# Altium schematic sheet 19_SOLEDNOID_2.SchDoc
size 420 x 297 mm; SheetNumber: 31; SheetTotal: 33
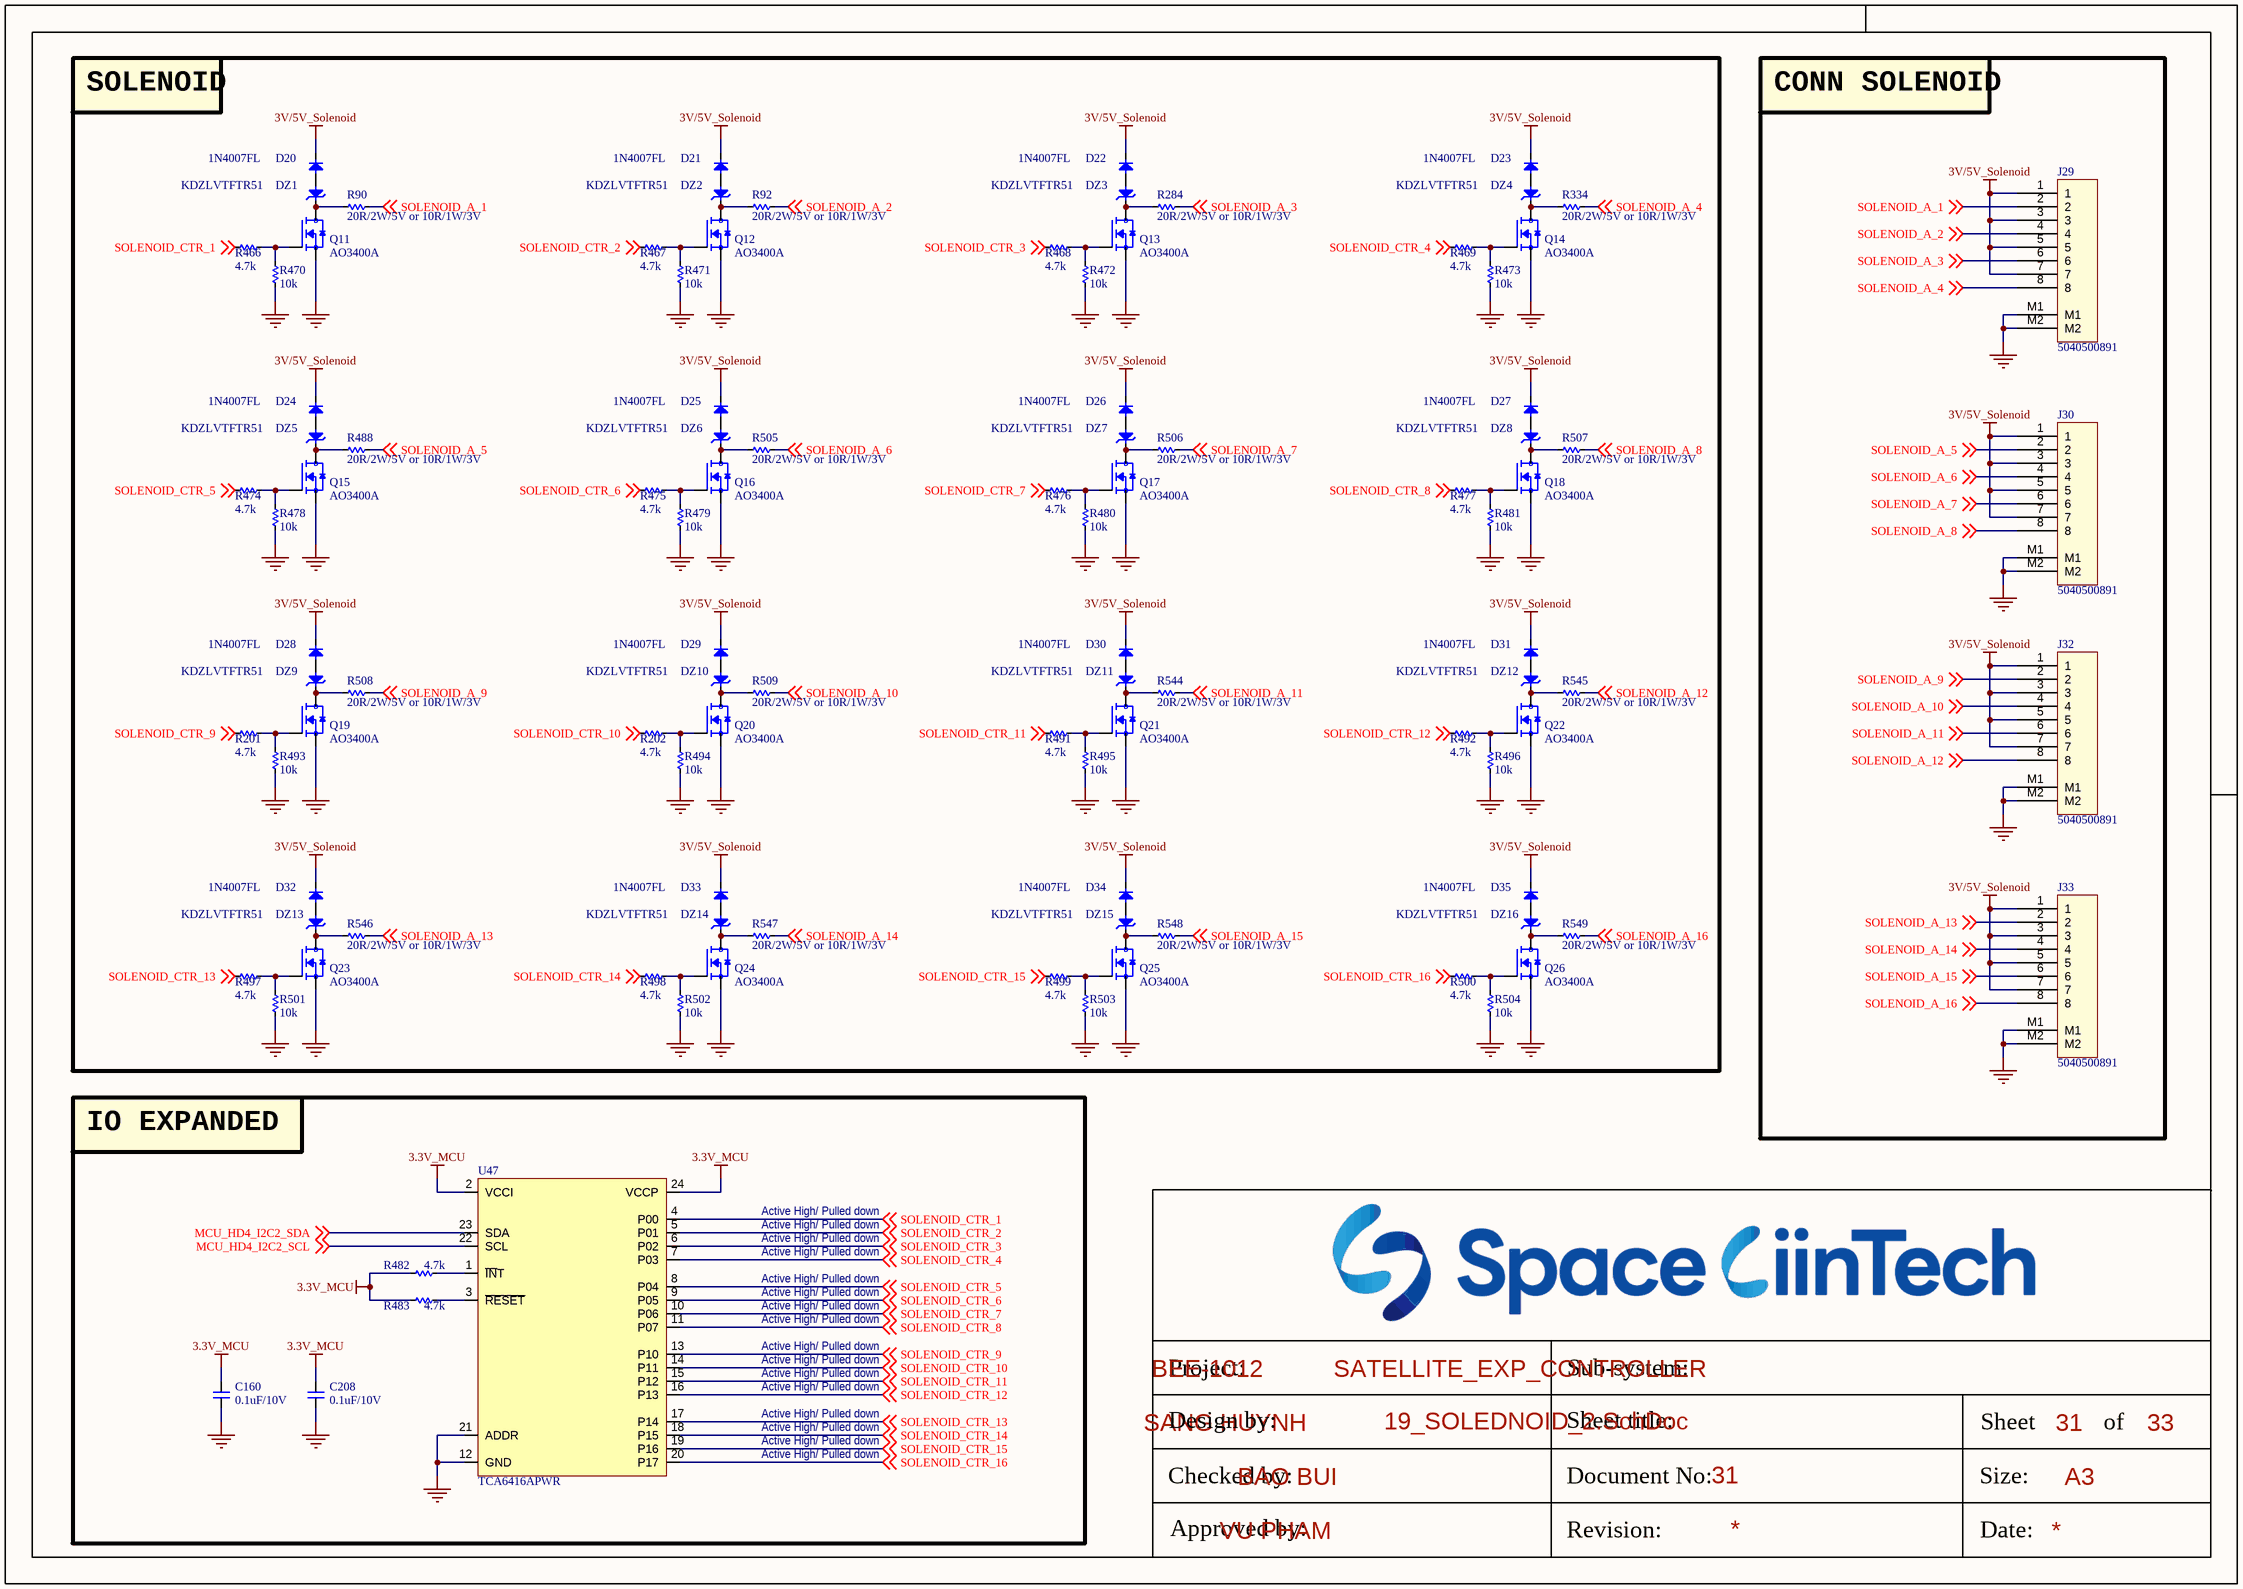
[diagram p0: 19_SOLEDNOID_2.SchDoc]

## Parts
C160  0.1uF/10V  [CAP_C_1005X50_L]
C208  0.1uF/10V  [CAP_C_1005X50_L]
D20  1N4007FL  [SOD3717X145N]
D21  1N4007FL  [SOD3717X145N]
D22  1N4007FL  [SOD3717X145N]
D23  1N4007FL  [SOD3717X145N]
D24  1N4007FL  [SOD3717X145N]
D25  1N4007FL  [SOD3717X145N]
D26  1N4007FL  [SOD3717X145N]
D27  1N4007FL  [SOD3717X145N]
D28  1N4007FL  [SOD3717X145N]
D29  1N4007FL  [SOD3717X145N]
D30  1N4007FL  [SOD3717X145N]
D31  1N4007FL  [SOD3717X145N]
D32  1N4007FL  [SOD3717X145N]
D33  1N4007FL  [SOD3717X145N]
D34  1N4007FL  [SOD3717X145N]
D35  1N4007FL  [SOD3717X145N]
DZ1  KDZLVTFTR51  [SOD3717X145N]
DZ2  KDZLVTFTR51  [SOD3717X145N]
DZ3  KDZLVTFTR51  [SOD3717X145N]
DZ4  KDZLVTFTR51  [SOD3717X145N]
DZ5  KDZLVTFTR51  [SOD3717X145N]
DZ6  KDZLVTFTR51  [SOD3717X145N]
DZ7  KDZLVTFTR51  [SOD3717X145N]
DZ8  KDZLVTFTR51  [SOD3717X145N]
DZ9  KDZLVTFTR51  [SOD3717X145N]
DZ10  KDZLVTFTR51  [SOD3717X145N]
DZ11  KDZLVTFTR51  [SOD3717X145N]
DZ12  KDZLVTFTR51  [SOD3717X145N]
DZ13  KDZLVTFTR51  [SOD3717X145N]
DZ14  KDZLVTFTR51  [SOD3717X145N]
DZ15  KDZLVTFTR51  [SOD3717X145N]
DZ16  KDZLVTFTR51  [SOD3717X145N]
J29  5040500891  [MOLEX_5040500891]
J30  5040500891  [MOLEX_5040500891]
J32  5040500891  [MOLEX_5040500891]
J33  5040500891  [MOLEX_5040500891]
Q11  AO3400A  [SOT95P240X120-3N]
Q12  AO3400A  [SOT95P240X120-3N]
Q13  AO3400A  [SOT95P240X120-3N]
Q14  AO3400A  [SOT95P240X120-3N]
Q15  AO3400A  [SOT95P240X120-3N]
Q16  AO3400A  [SOT95P240X120-3N]
Q17  AO3400A  [SOT95P240X120-3N]
Q18  AO3400A  [SOT95P240X120-3N]
Q19  AO3400A  [SOT95P240X120-3N]
Q20  AO3400A  [SOT95P240X120-3N]
Q21  AO3400A  [SOT95P240X120-3N]
Q22  AO3400A  [SOT95P240X120-3N]
Q23  AO3400A  [SOT95P240X120-3N]
Q24  AO3400A  [SOT95P240X120-3N]
Q25  AO3400A  [SOT95P240X120-3N]
Q26  AO3400A  [SOT95P240X120-3N]
R90  20R/2W/5V or 10R/1W/3V  [RES_C_6331X65_N]
R92  20R/2W/5V or 10R/1W/3V  [RES_C_6331X65_N]
R201  4.7k  [RES_C_1005x30_L]
R202  4.7k  [RES_C_1005x30_L]
R284  20R/2W/5V or 10R/1W/3V  [RES_C_6331X65_N]
R334  20R/2W/5V or 10R/1W/3V  [RES_C_6331X65_N]
R466  4.7k  [RES_C_1005x30_L]
R467  4.7k  [RES_C_1005x30_L]
R468  4.7k  [RES_C_1005x30_L]
R469  4.7k  [RES_C_1005x30_L]
R470  10k  [RES_C_1005x30_L]
R471  10k  [RES_C_1005x30_L]
R472  10k  [RES_C_1005x30_L]
R473  10k  [RES_C_1005x30_L]
R474  4.7k  [RES_C_1005x30_L]
R475  4.7k  [RES_C_1005x30_L]
R476  4.7k  [RES_C_1005x30_L]
R477  4.7k  [RES_C_1005x30_L]
R478  10k  [RES_C_1005x30_L]
R479  10k  [RES_C_1005x30_L]
R480  10k  [RES_C_1005x30_L]
R481  10k  [RES_C_1005x30_L]
R482  4.7k  [RES_C_1005x30_L]
R483  4.7k  [RES_C_1005x30_L]
R488  20R/2W/5V or 10R/1W/3V  [RES_C_6331X65_N]
R491  4.7k  [RES_C_1005x30_L]
R492  4.7k  [RES_C_1005x30_L]
R493  10k  [RES_C_1005x30_L]
R494  10k  [RES_C_1005x30_L]
R495  10k  [RES_C_1005x30_L]
R496  10k  [RES_C_1005x30_L]
R497  4.7k  [RES_C_1005x30_L]
R498  4.7k  [RES_C_1005x30_L]
R499  4.7k  [RES_C_1005x30_L]
R500  4.7k  [RES_C_1005x30_L]
R501  10k  [RES_C_1005x30_L]
R502  10k  [RES_C_1005x30_L]
R503  10k  [RES_C_1005x30_L]
R504  10k  [RES_C_1005x30_L]
R505  20R/2W/5V or 10R/1W/3V  [RES_C_6331X65_N]
R506  20R/2W/5V or 10R/1W/3V  [RES_C_6331X65_N]
R507  20R/2W/5V or 10R/1W/3V  [RES_C_6331X65_N]
R508  20R/2W/5V or 10R/1W/3V  [RES_C_6331X65_N]
R509  20R/2W/5V or 10R/1W/3V  [RES_C_6331X65_N]
R544  20R/2W/5V or 10R/1W/3V  [RES_C_6331X65_N]
R545  20R/2W/5V or 10R/1W/3V  [RES_C_6331X65_N]
R546  20R/2W/5V or 10R/1W/3V  [RES_C_6331X65_N]
R547  20R/2W/5V or 10R/1W/3V  [RES_C_6331X65_N]
R548  20R/2W/5V or 10R/1W/3V  [RES_C_6331X65_N]
R549  20R/2W/5V or 10R/1W/3V  [RES_C_6331X65_N]
U47  TCA6416APWR  [SOP65P440W-24N]

## Blocks framed on the sheet
SOLENOID: D20-D35 DZ1-DZ16 Q11-Q26 R90 R92 R201 R202 R284 R334 R466-R481 R488 R491-R509 R544-R549
CONN SOLENOID: J29 J30 J32 J33
IO EXPANDED: C160 C208 R482 R483 U47

## Nets
3.3V_MCU: C160.2 C208.2 R482.1 R483.1 U47.2(VCCI) U47.24(VCCP)
3V/5V_Solenoid: D20.1(K) D21.1(K) D22.1(K) D23.1(K) D24.1(K) D25.1(K) D26.1(K) D27.1(K) D28.1(K) D29.1(K) D30.1(K) D31.1(K) D32.1(K) D33.1(K) D34.1(K) D35.1(K) J29.1 J29.3 J29.5 J29.7 J30.1 J30.3 J30.5 J30.7 J32.1 J32.3 J32.5 J32.7 J33.1 J33.3 J33.5 J33.7
GND: C160.1 C208.1 J29.M1 J29.M2 J30.M1 J30.M2 J32.M1 J32.M2 J33.M1 J33.M2 Q11.2(S) Q12.2(S) Q13.2(S) Q14.2(S) Q15.2(S) Q16.2(S) Q17.2(S) Q18.2(S) Q19.2(S) Q20.2(S) Q21.2(S) Q22.2(S) Q23.2(S) Q24.2(S) Q25.2(S) Q26.2(S) R470.1 R471.1 R472.1 R473.1 R478.1 R479.1 R480.1 R481.1 R493.1 R494.1 R495.1 R496.1 R501.1 R502.1 R503.1 R504.1 U47.12(GND) U47.21(ADDR)
MCU_HD4_I2C2_SCL: U47.22(SCL) ; off-sheet MCU_HD4_I2C2_SCL
MCU_HD4_I2C2_SDA: U47.23(SDA) ; off-sheet MCU_HD4_I2C2_SDA
SOLENOID_A_1: J29.2 R90.1 ; off-sheet SOLENOID_A_1
SOLENOID_A_2: J29.4 R92.1 ; off-sheet SOLENOID_A_2
SOLENOID_A_3: J29.6 R284.1 ; off-sheet SOLENOID_A_3
SOLENOID_A_4: J29.8 R334.1 ; off-sheet SOLENOID_A_4
SOLENOID_A_5: J30.2 R488.1 ; off-sheet SOLENOID_A_5
SOLENOID_A_6: J30.4 R505.1 ; off-sheet SOLENOID_A_6
SOLENOID_A_7: J30.6 R506.1 ; off-sheet SOLENOID_A_7
SOLENOID_A_8: J30.8 R507.1 ; off-sheet SOLENOID_A_8
SOLENOID_A_9: J32.2 R508.1 ; off-sheet SOLENOID_A_9
SOLENOID_A_10: J32.4 R509.1 ; off-sheet SOLENOID_A_10
SOLENOID_A_11: J32.6 R544.1 ; off-sheet SOLENOID_A_11
SOLENOID_A_12: J32.8 R545.1 ; off-sheet SOLENOID_A_12
SOLENOID_A_13: J33.2 R546.1 ; off-sheet SOLENOID_A_13
SOLENOID_A_14: J33.4 R547.1 ; off-sheet SOLENOID_A_14
SOLENOID_A_15: J33.6 R548.1 ; off-sheet SOLENOID_A_15
SOLENOID_A_16: J33.8 R549.1 ; off-sheet SOLENOID_A_16
SOLENOID_CTR_1: R466.2 U47.4(P00) ; off-sheet SOLENOID_CTR_1
SOLENOID_CTR_2: R467.2 U47.5(P01) ; off-sheet SOLENOID_CTR_2
SOLENOID_CTR_3: R468.2 U47.6(P02) ; off-sheet SOLENOID_CTR_3
SOLENOID_CTR_4: R469.2 U47.7(P03) ; off-sheet SOLENOID_CTR_4
SOLENOID_CTR_5: R474.2 U47.8(P04) ; off-sheet SOLENOID_CTR_5
SOLENOID_CTR_6: R475.2 U47.9(P05) ; off-sheet SOLENOID_CTR_6
SOLENOID_CTR_7: R476.2 U47.10(P06) ; off-sheet SOLENOID_CTR_7
SOLENOID_CTR_8: R477.2 U47.11(P07) ; off-sheet SOLENOID_CTR_8
SOLENOID_CTR_9: R201.2 U47.13(P10) ; off-sheet SOLENOID_CTR_9
SOLENOID_CTR_10: R202.2 U47.14(P11) ; off-sheet SOLENOID_CTR_10
SOLENOID_CTR_11: R491.2 U47.15(P12) ; off-sheet SOLENOID_CTR_11
SOLENOID_CTR_12: R492.2 U47.16(P13) ; off-sheet SOLENOID_CTR_12
SOLENOID_CTR_13: R497.2 U47.17(P14) ; off-sheet SOLENOID_CTR_13
SOLENOID_CTR_14: R498.2 U47.18(P15) ; off-sheet SOLENOID_CTR_14
SOLENOID_CTR_15: R499.2 U47.19(P16) ; off-sheet SOLENOID_CTR_15
SOLENOID_CTR_16: R500.2 U47.20(P17) ; off-sheet SOLENOID_CTR_16
NetD20_2: D20.2(A) DZ1.2(A)
NetD21_2: D21.2(A) DZ2.2(A)
NetD22_2: D22.2(A) DZ3.2(A)
NetD23_2: D23.2(A) DZ4.2(A)
NetD24_2: D24.2(A) DZ5.2(A)
NetD25_2: D25.2(A) DZ6.2(A)
NetD26_2: D26.2(A) DZ7.2(A)
NetD27_2: D27.2(A) DZ8.2(A)
NetD28_2: D28.2(A) DZ9.2(A)
NetD29_2: D29.2(A) DZ10.2(A)
NetD30_2: D30.2(A) DZ11.2(A)
NetD31_2: D31.2(A) DZ12.2(A)
NetD32_2: D32.2(A) DZ13.2(A)
NetD33_2: D33.2(A) DZ14.2(A)
NetD34_2: D34.2(A) DZ15.2(A)
NetD35_2: D35.2(A) DZ16.2(A)
NetDZ1_1: DZ1.1(K) Q11.3(D) R90.2
NetDZ2_1: DZ2.1(K) Q12.3(D) R92.2
NetDZ3_1: DZ3.1(K) Q13.3(D) R284.2
NetDZ4_1: DZ4.1(K) Q14.3(D) R334.2
NetDZ5_1: DZ5.1(K) Q15.3(D) R488.2
NetDZ6_1: DZ6.1(K) Q16.3(D) R505.2
NetDZ7_1: DZ7.1(K) Q17.3(D) R506.2
NetDZ8_1: DZ8.1(K) Q18.3(D) R507.2
NetDZ9_1: DZ9.1(K) Q19.3(D) R508.2
NetDZ10_1: DZ10.1(K) Q20.3(D) R509.2
NetDZ11_1: DZ11.1(K) Q21.3(D) R544.2
NetDZ12_1: DZ12.1(K) Q22.3(D) R545.2
NetDZ13_1: DZ13.1(K) Q23.3(D) R546.2
NetDZ14_1: DZ14.1(K) Q24.3(D) R547.2
NetDZ15_1: DZ15.1(K) Q25.3(D) R548.2
NetDZ16_1: DZ16.1(K) Q26.3(D) R549.2
NetQ11_1: Q11.1(G) R466.1 R470.2
NetQ12_1: Q12.1(G) R467.1 R471.2
NetQ13_1: Q13.1(G) R468.1 R472.2
NetQ14_1: Q14.1(G) R469.1 R473.2
NetQ15_1: Q15.1(G) R474.1 R478.2
NetQ16_1: Q16.1(G) R475.1 R479.2
NetQ17_1: Q17.1(G) R476.1 R480.2
NetQ18_1: Q18.1(G) R477.1 R481.2
NetQ19_1: Q19.1(G) R201.1 R493.2
NetQ20_1: Q20.1(G) R202.1 R494.2
NetQ21_1: Q21.1(G) R491.1 R495.2
NetQ22_1: Q22.1(G) R492.1 R496.2
NetQ23_1: Q23.1(G) R497.1 R501.2
NetQ24_1: Q24.1(G) R498.1 R502.2
NetQ25_1: Q25.1(G) R499.1 R503.2
NetQ26_1: Q26.1(G) R500.1 R504.2
NetR482_2: R482.2 U47.1(~{IN}T)
NetR483_2: R483.2 U47.3(~{RESET})

## Notes on the sheet
- Active High/ Pulled down
- Project:
- BEE-1012
- Sub-system:
- SATELLITE_EXP_CONTROLLER
- Design by:
- SANG HUYNH
- BAO BUI
- Sheet title:
- Sheet
- A3
- of
- Checked by:
- Approved by:
- VU PHAM
- Revision:
- Document No:
- Size:
- Date:

## Library data of the parts
C160 C208 = _CAP_C_2: CAP
D20-D35 = Diode SMD: Default Diode; Code - JEDEC: DO-214-AB; Value: 1N5007; Published: 8-Jun-2000; Revision: July-2002: Re-released for DXP Platform.; Publisher: Altium Limited
DZ1-DZ16 = DIODE Zener: Zenner
J29 J30 J32 J33 = Header 8x1_2M
Q11-Q26 = MOSFET_N: N-Channel 30 V 5.7A (Ta) 1.4W (Ta) Surface Mount SOT-23-3; MF: Alpha & Omega Semiconductor; SnapEDA_Link: https://www.snapeda.com/parts/AO3400A/Alpha/view-part/?ref=snap; Package: SOT-23 Alpha &amp; Omega Semiconductor Inc.; Value: *; MP: AO3400A; Check_prices: https://www.snapeda.com/parts/AO3400A/Alpha/view-part/?ref=eda
R90 R92 R201 R202 R284 R334 R466-R483 R488 R491-R509 R544-R549 = _RES_B_2: RES
U47 = IC_I2Cto16IO_TCA6416APWR